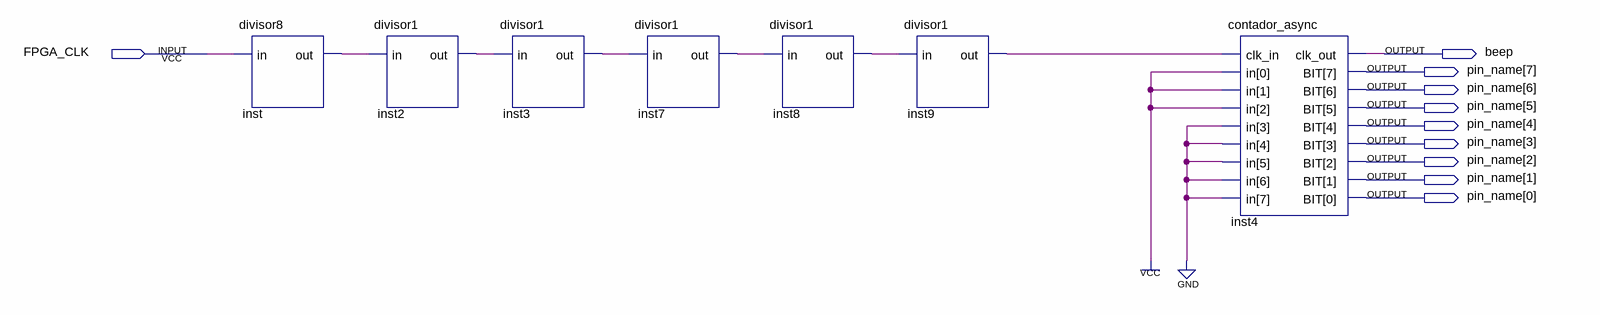
[diagram p0: schematic sheet]
// Quartus schematic buzzer_440hz.bdf as structural Verilog: 7 symbols, 10 pins
module buzzer_440hz (
  input  FPGA_CLK,
  output beep,
  output [7:0] pin_name
);

  wire inst2_out, inst3_out, inst7_out, inst8_out, inst9_out, inst_out;

  divisor8 inst (.in(FPGA_CLK), .out(inst_out));
  divisor1 inst2 (.in(inst_out), .out(inst2_out));
  divisor1 inst3 (.in(inst2_out), .out(inst3_out));
  divisor1 inst7 (.in(inst3_out), .out(inst7_out));
  divisor1 inst8 (.in(inst7_out), .out(inst8_out));
  divisor1 inst9 (.in(inst8_out), .out(inst9_out));
  contador_async inst4 (.clk_in(inst9_out), .in(8'b00000111), .clk_out(beep), .BIT(pin_name));
endmodule
